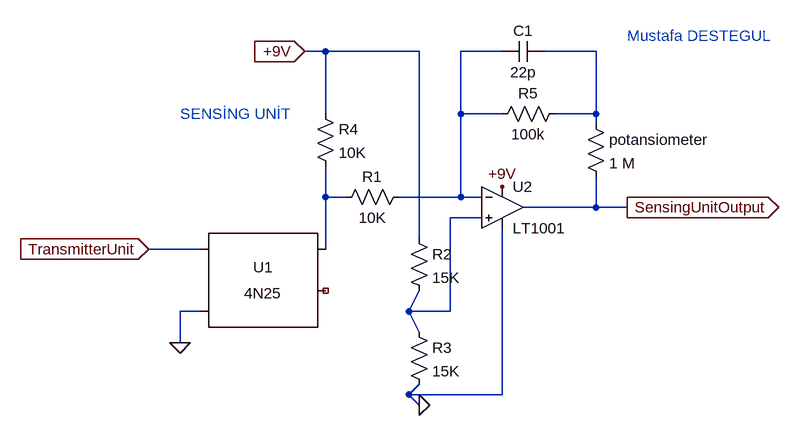
[diagram p0: schematic Draft2.asc]
Draft2.asc, the LTspice schematic file:
Version 4
SHEET 1 1044 680
WIRE 304 -192 272 -192
WIRE 448 -192 304 -192
WIRE 576 -192 512 -192
WIRE 720 -192 640 -192
WIRE 304 -96 304 -192
WIRE 512 -96 512 -192
WIRE 576 -96 512 -96
WIRE 720 -96 720 -192
WIRE 720 -96 656 -96
WIRE 720 -80 720 -96
WIRE 304 32 304 -16
WIRE 336 32 304 32
WIRE 512 32 512 -96
WIRE 512 32 416 32
WIRE 544 32 512 32
WIRE 720 48 720 0
WIRE 720 48 608 48
WIRE 768 48 720 48
WIRE 544 64 496 64
WIRE 448 96 448 -192
WIRE 112 112 32 112
WIRE 304 112 304 32
WIRE 112 208 80 208
WIRE 432 208 448 176
WIRE 496 208 496 64
WIRE 496 208 432 208
WIRE 448 240 432 208
WIRE 80 256 80 208
WIRE 432 336 448 320
WIRE 576 336 576 80
WIRE 576 336 432 336
WIRE 448 352 432 336
FLAG 32 112 TransmitterUnit
IOPIN 32 112 In
FLAG 80 256 0
FLAG 448 352 0
FLAG 272 -192 +9V
IOPIN 272 -192 In
FLAG 576 16 +9V
FLAG 768 48 SensingUnitOutput
IOPIN 768 48 Out
SYMBOL Optos\\4N25 208 176 R0
SYMATTR InstName U1
SYMBOL Opamps\\LT1001 576 -16 R0
SYMATTR InstName U2
SYMBOL res 432 16 R90
WINDOW 0 0 56 VBottom 2
WINDOW 3 32 56 VTop 2
SYMATTR InstName R1
SYMATTR Value 10K
SYMBOL res 432 80 R0
SYMATTR InstName R2
SYMATTR Value 15K
SYMBOL res 432 224 R0
SYMATTR InstName R3
SYMATTR Value 15K
SYMBOL res 288 -112 R0
SYMATTR InstName R4
SYMATTR Value 10K
SYMBOL res 672 -112 R90
WINDOW 0 0 56 VBottom 2
WINDOW 3 32 56 VTop 2
SYMATTR InstName R5
SYMATTR Value 100k
SYMBOL res 704 -96 R0
SYMATTR InstName potansiometer
SYMATTR Value 1 M
SYMBOL cap 640 -208 R90
WINDOW 0 0 32 VBottom 2
WINDOW 3 32 32 VTop 2
SYMATTR InstName C1
SYMATTR Value 22p
TEXT 80 -96 Left 2 ;SENSİNG UNİT
TEXT 768 -216 Left 2 ;Mustafa DESTEGUL

The netlist it stands for:
* Draft2.asc
XU1 TransmitterUnit 0 N003 NC_01 NC_02 4N25
XU2 N004 N001 +9V 0 SensingUnitOutput LT1001  ; pins In+ In- V+ V- OUT
R1 N001 N003 10K
R2 +9V N004 15K
R3 N004 0 15K
R4 +9V N003 10K
R5 N002 N001 100k
R§potansiometer N002 SensingUnitOutput 1 M
C1 N002 N001 22p
* SENSİNG UNİT
* Mustafa DESTEGUL
.lib 4N25.sub
.lib LTC.lib
.backanno
.end